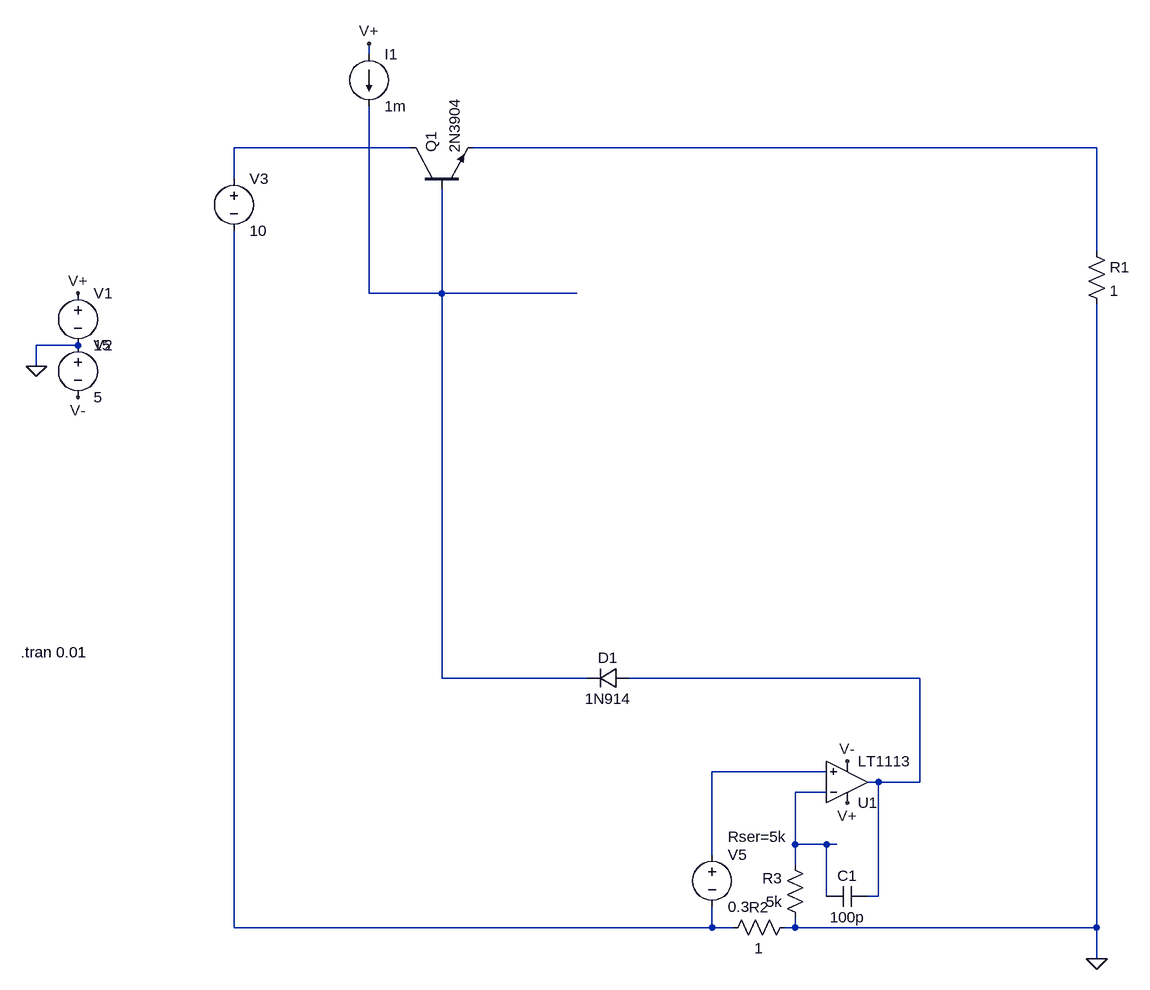
[diagram p0: schematic blackdog_inverted_aug26.asc]
blackdog_inverted_aug26.asc, the LTspice schematic file:
Version 4
SHEET 1 1296 1028
WIRE -1184 -384 -1184 -400
WIRE -1120 -240 -1392 -240
WIRE -64 -240 -1024 -240
WIRE -1392 -192 -1392 -240
WIRE -64 -80 -64 -240
WIRE -1184 -16 -1184 -304
WIRE -1072 -16 -1072 -176
WIRE -1072 -16 -1184 -16
WIRE -864 -16 -1072 -16
WIRE -1632 64 -1696 64
WIRE -1696 96 -1696 64
WIRE -1072 576 -1072 -16
WIRE -848 576 -1072 576
WIRE -336 576 -784 576
WIRE -480 720 -656 720
WIRE -400 736 -416 736
WIRE -336 736 -336 576
WIRE -336 736 -400 736
WIRE -480 752 -528 752
WIRE -528 832 -528 752
WIRE -480 832 -528 832
WIRE -464 832 -480 832
WIRE -656 848 -656 720
WIRE -528 864 -528 832
WIRE -480 912 -480 832
WIRE -400 912 -400 736
WIRE -400 912 -416 912
WIRE -1392 960 -1392 -112
WIRE -656 960 -656 928
WIRE -656 960 -1392 960
WIRE -624 960 -656 960
WIRE -528 960 -528 944
WIRE -528 960 -544 960
WIRE -64 960 -64 0
WIRE -64 960 -528 960
WIRE -64 1008 -64 960
FLAG -1696 96 0
FLAG -1632 -16 V+
FLAG -1632 144 V-
FLAG -1184 -400 V+
FLAG -64 1008 0
FLAG -448 768 V+
FLAG -448 704 V-
SYMBOL voltage -1632 -32 R0
WINDOW 123 0 0 Left 0
WINDOW 39 0 0 Left 0
SYMATTR InstName V1
SYMATTR Value 15
SYMBOL voltage -1632 48 R0
WINDOW 123 0 0 Left 0
WINDOW 39 0 0 Left 0
SYMATTR InstName V2
SYMATTR Value 5
SYMBOL Opamps\\LT1113 -448 800 M180
SYMATTR InstName U1
SYMBOL npn -1120 -176 R270
SYMATTR InstName Q1
SYMATTR Value 2N3904
SYMBOL voltage -1392 -208 R0
WINDOW 123 0 0 Left 0
WINDOW 39 0 0 Left 0
SYMATTR InstName V3
SYMATTR Value 10
SYMBOL current -1184 -384 R0
WINDOW 123 0 0 Left 0
WINDOW 39 0 0 Left 0
SYMATTR InstName I1
SYMATTR Value 1m
SYMBOL diode -784 560 R90
WINDOW 0 0 32 VBottom 2
WINDOW 3 32 32 VTop 2
SYMATTR InstName D1
SYMATTR Value 1N914
SYMBOL res -80 -96 R0
SYMATTR InstName R1
SYMATTR Value 1
SYMBOL res -528 944 R90
WINDOW 0 0 56 VBottom 2
WINDOW 3 32 56 VTop 2
SYMATTR InstName R2
SYMATTR Value 1
SYMBOL res -512 960 R180
WINDOW 0 36 76 Left 2
WINDOW 3 36 40 Left 2
SYMATTR InstName R3
SYMATTR Value 5k
SYMBOL voltage -656 832 R0
WINDOW 123 0 0 Left 0
WINDOW 39 24 -12 Left 2
SYMATTR SpiceLine Rser=5k
SYMATTR InstName V5
SYMATTR Value 0.3
SYMBOL cap -480 928 R270
WINDOW 0 32 32 VTop 2
WINDOW 3 0 32 VBottom 2
SYMATTR InstName C1
SYMATTR Value 100p
TEXT -1720 536 Left 2 !.tran 0.01

The netlist it stands for:
* blackdog_inverted_aug26.asc
V1 V+ 0 15
V2 0 V- 5
XU1 N005 N006 V+ V- N004 LT1113  ; pins In+ In- V+ V- OUT
Q1 N001 N003 N002 0 2N3904
V3 N001 N007 10
I1 V+ N003 1m
D1 N004 N003 1N914
R1 N002 0 1
R2 0 N007 1
R3 0 N006 5k
V5 N005 N007 0.3 Rser=5k
C1 N006 N004 100p
.model D D
.lib standard.dio
.model NPN NPN
.model PNP PNP
.lib standard.bjt
.tran 0.01
.backanno
.end